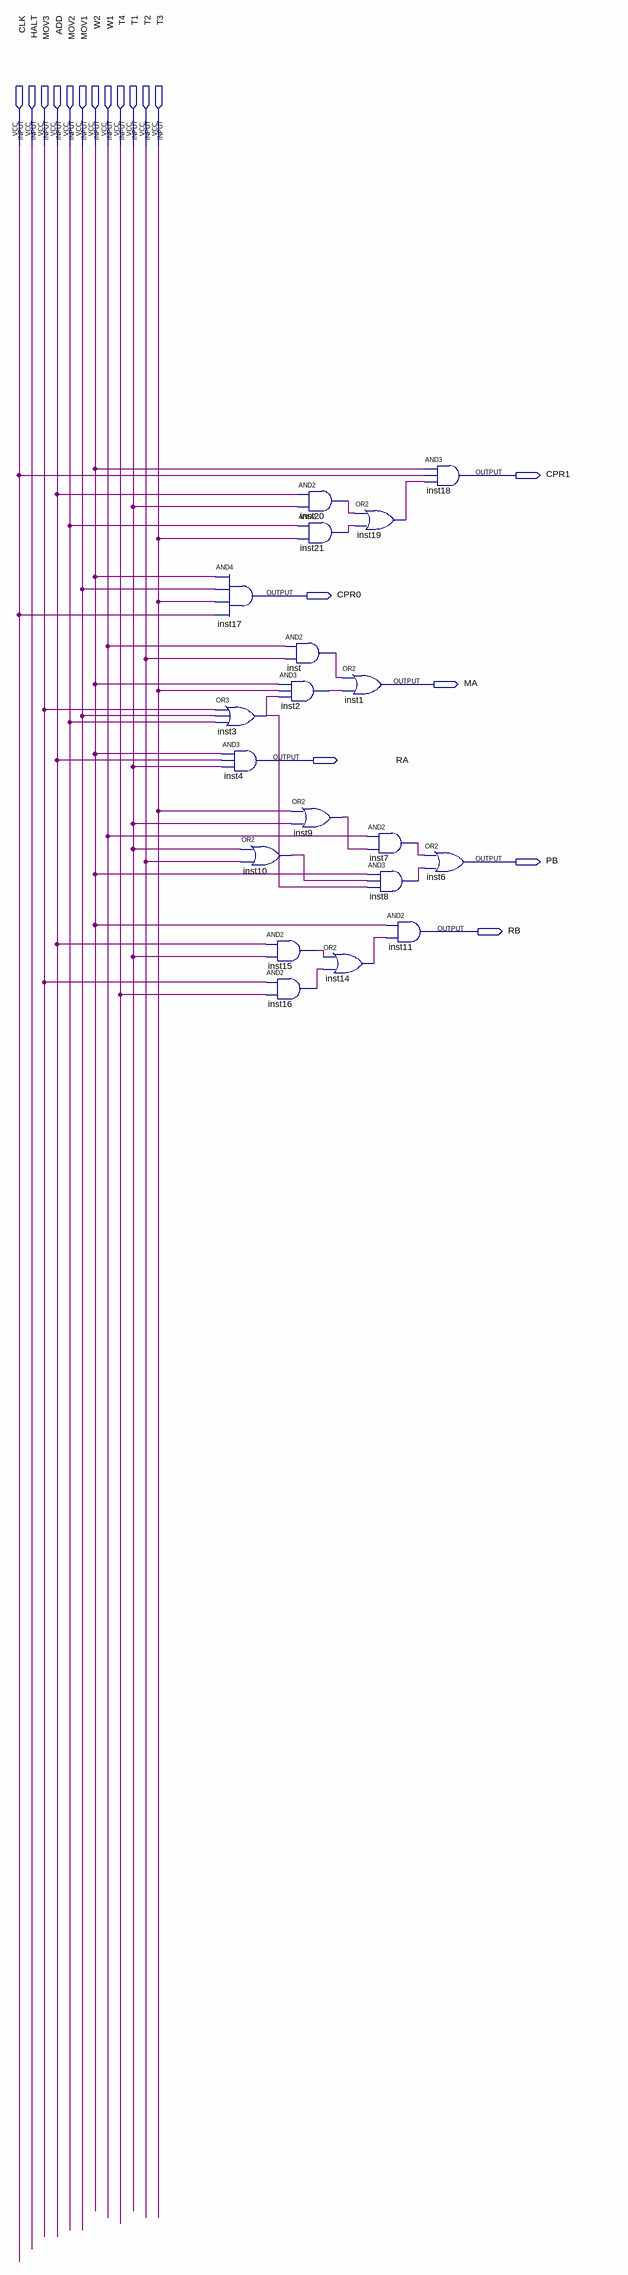
[diagram p0: schematic sheet]
// Quartus schematic control2.bdf as structural Verilog: 19 symbols, 18 pins
module control2 (
  input  CLK,
  input  HALT,
  input  MOV3,
  input  ADD,
  input  MOV2,
  input  MOV1,
  input  W2,
  input  W1,
  input  T4,
  input  T1,
  input  T2,
  input  T3,
  output CPR1,
  output CPR0,
  output MA,
  output RA,
  output PB,
  output RB
);

  wire inst2_out, inst3_out, inst7_out, inst8_out, inst9_out, inst10_out, inst14_out, inst15_out, inst16_out,
       inst19_out, inst20_out, inst21_out, inst_out;

  and inst17 (CPR0, W2, MOV1, T3, CLK);
  or inst3 (inst3_out, MOV3, MOV1, MOV2);
  and inst4 (RA, W2, ADD, T1);
  or inst10 (inst10_out, T1, T2);
  and inst15 (inst15_out, ADD, T1);
  and inst16 (inst16_out, MOV3, T4);
  and inst20 (inst20_out, ADD, T1);
  and inst21 (inst21_out, MOV2, T3);
  and inst (inst_out, W1, T2);
  and inst2 (inst2_out, W2, T3, inst3_out);
  or inst9 (inst9_out, T3, T1);
  or inst14 (inst14_out, inst15_out, inst16_out);
  or inst19 (inst19_out, inst20_out, inst21_out);
  or inst1 (MA, inst_out, inst2_out);
  and inst7 (inst7_out, W1, inst9_out);
  and inst8 (inst8_out, W2, inst10_out, inst3_out);
  and inst18 (CPR1, W2, CLK, inst19_out);
  or inst6 (PB, inst7_out, inst8_out);
  and inst11 (RB, W2, inst14_out);
endmodule
